# EAGLE design attiny44 (EAGLE 7.7.0)
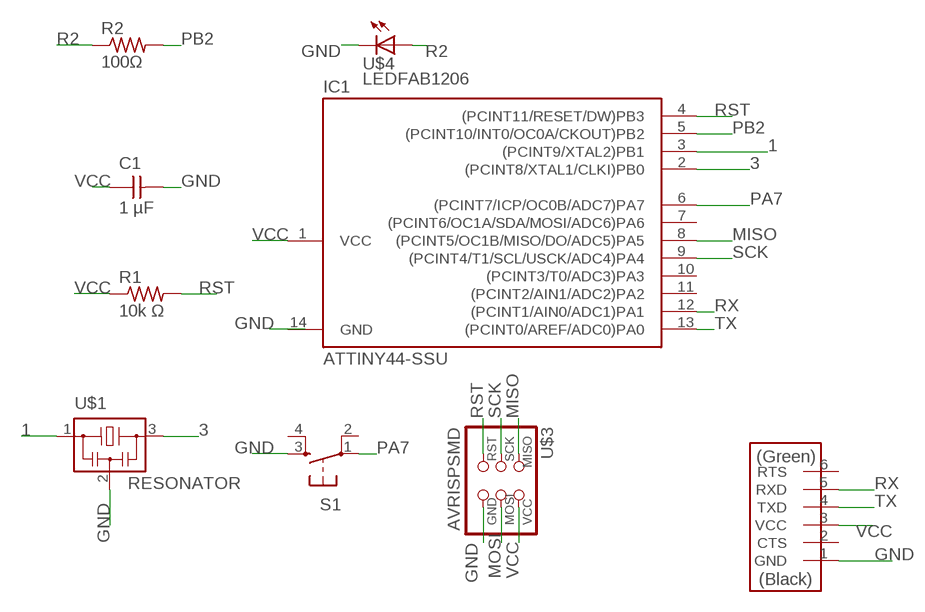
[diagram p0: schematic, sheet 1]

## Parts
C1  1 µF  CAP-UNPOLARIZEDFAB  [C1206FAB]
IC1  ATTINY44-SSU  [SOIC14]
R1  10k Ω  RES-US1206FAB  [R1206FAB]
R2  100Ω  RES-US1206FAB  [R1206FAB]
S1  6MM_SWITCH6MM_SWITCH  [6MM_SWITCH]
U$1  RESONATOR  [EFOBM]
U$2  FTDI-SMD-HEADER  [1X06SMD]
U$3  AVRISPSMD  [2X03SMD]
U$4  LEDFAB1206  [LED1206FAB]

## Nets
1: IC1.3((PCINT9/XTAL2)PB1) U$1.1
3: IC1.2((PCINT8/XTAL1/CLKI)PB0) U$1.3
GND: C1.2 S1.3(S) U$1.2 U$2.1(GND) U$3.6(GND) U$4.2(C)
MISO: IC1.8((PCINT5/OC1B/MISO/DO/ADC5)PA5) U$3.1(MISO)
MOSI: U$3.4(MOSI)
PA7: IC1.6((PCINT7/ICP/OC0B/ADC7)PA7) S1.1(P)
PB2: IC1.5((PCINT10/INT0/OC0A/CKOUT)PB2) R2.2
R2: R2.1 U$4.1(A)
RST: IC1.4((PCINT11/RESET/DW)PB3) R1.2 U$3.5(RST)
RX: IC1.12((PCINT1/AIN0/ADC1)PA1) U$2.5(RXD)
SCK: IC1.9((PCINT4/T1/SCL/USCK/ADC4)PA4) U$3.3(SCK)
TX: IC1.13((PCINT0/AREF/ADC0)PA0) U$2.4(TXD)
VCC: C1.1 IC1.1(VCC) R1.1 U$2.3(VCC) U$3.2(VCC)
Unconnected: IC1.7((PCINT6/OC1A/SDA/MOSI/ADC6)PA6) IC1.10((PCINT3/T0/ADC3)PA3) IC1.11((PCINT2/AIN1/ADC2)PA2) S1.2(P1) S1.4(S1) U$2.2(CTS) U$2.6(RTS)

## Power pins joined to a net without a drawn wire
GND: IC1.14(GND)

## Library data of the parts
C1 = 0_fab:CAP-UNPOLARIZED
IC1 = 0_fab:ATTINY44
R1 R2 = 0_fab:RES-US: Resistor (US Symbol) Variants with postfix FAB are widened to allow the routing of internal traces
S1 = 0_fab:6MM_SWITCH: OMRON SWITCH
U$1 = 0_fab:RESONATOR
U$2 = 0_fab:FTDI-SMD-HEADER
U$3 = 0_fab:AVRISP
U$4 = 0_fab:LED: LED

## Board
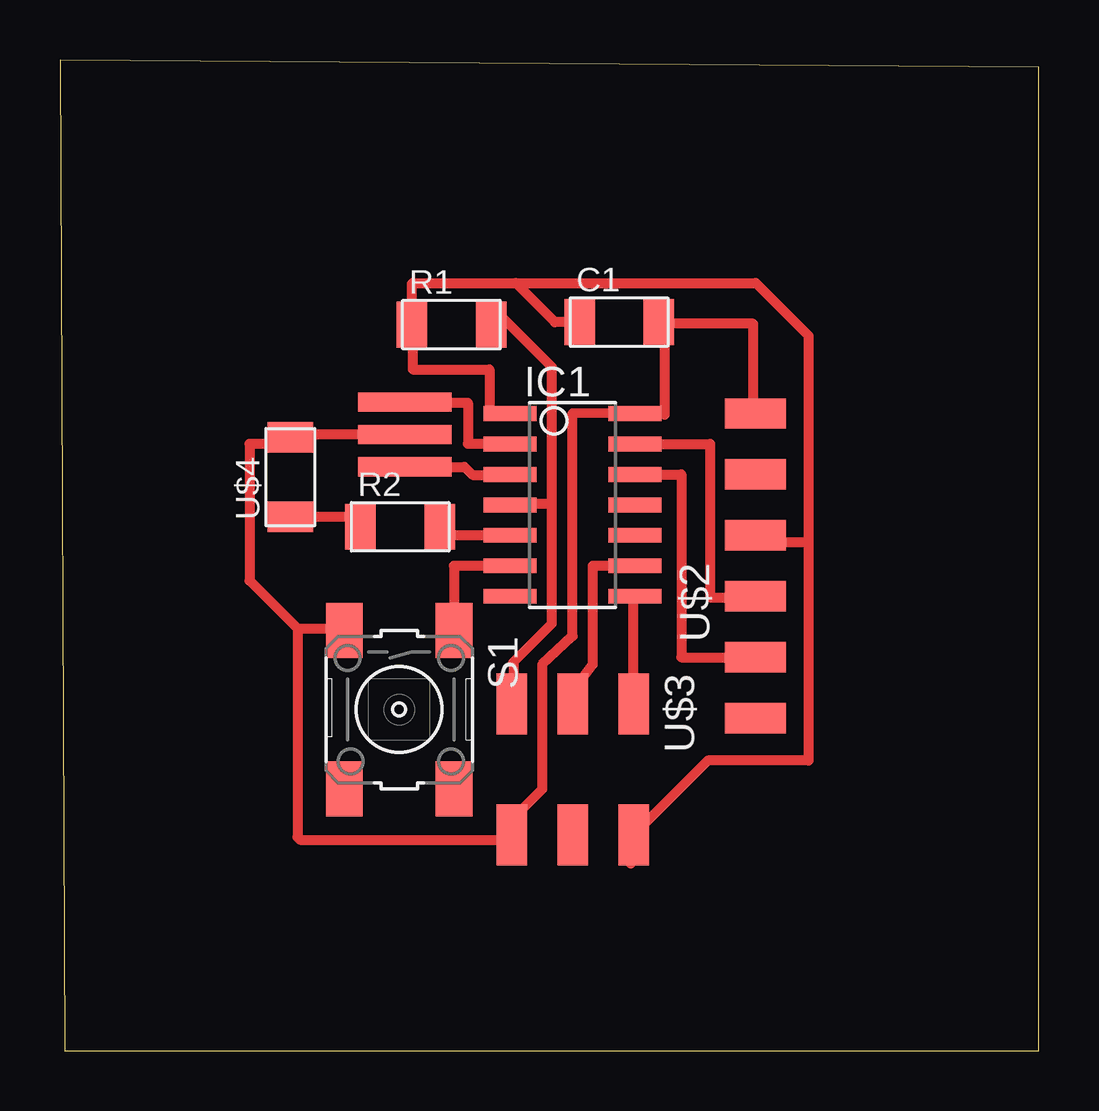
[diagram p1: board, top side]

Size 40.8 x 41.3 mm. Coordinates in mm from the lower left corner, seen from the top.
Outline: 0.2,0 40.8,0 40.8,41 0,41.3 0.2,0
Copper layers (1*16): Top 0.035mm / dielectric 1.5mm / Bottom 0.035mm
Design rules "default *": minimum track width 16mil, minimum drill 24mil, track to track 16mil, track to pad 16mil, pad to pad 16mil, via to via 16mil, smd to smd 16mil, copper to edge 40mil, drill to drill 8mil, minimum pad ring 10mil, minimum via ring 8mil, stop-mask expansion 4mil, vias tented up to drill 0mil, thermal gap 10mil

### Footprints (pad centres in the part's own frame; a part is rotated, then mirrored left to right if it is on the bottom)
C1206FAB = smd 1.27 x 1.905: 1 -1.651,0; 2 1.651,0
SOIC14 = smd 0.61 x 2.21: 1 -3.81,-2.603; 2 -2.54,-2.603; 3 -1.27,-2.603; 4 0,-2.603; 5 1.27,-2.603; 6 2.54,-2.603; 7 3.81,-2.603; 8 3.81,2.603; 9 2.54,2.603; 10 1.27,2.603; 11 0,2.603; 12 -1.27,2.603; 13 -2.54,2.603; 14 -3.81,2.603
R1206FAB = smd 1.27 x 1.905: 1 -1.651,0; 2 1.651,0
6MM_SWITCH = smd 2.286 x 1.524: 1 -3.302,2.286; 2 3.302,2.286; 3 -3.302,-2.286; 4 3.302,-2.286
EFOBM = smd 0.8 x 3.9: 1 -1.35,0; 2 0,0; 3 1.35,0
1X06SMD = smd 2.54 x 1.27: 1 0,6.35; 2 0,3.81; 3 0,1.27; 4 0,-1.27; 5 0,-3.81; 6 0,-6.35
2X03SMD = smd 2.54 x 1.27: 1 -2.54,2.54; 2 2.92,2.54; 3 -2.54,0; 4 2.92,0; 5 -2.54,-2.54; 6 2.92,-2.54
LED1206FAB = smd 1.27 x 1.905: 1 -1.651,0; 2 1.651,0

### Placement (x,y rotation side)
C1  23.31,30.37 0 top
IC1  21.37,22.75 270 top
R1  16.32,30.27 0 top
R2  14.18,21.84 0 top
S1  14.14,14.22 270 top
U$1  14.38,25.69 90 top
U$2  28.99,20.21 0 top
U$3  21.37,11.92 270 top
U$4  9.6,23.91 90 top

### Tracks (layer width: path | path; a pad name or v marks a point on that pad's centre or on a via)
1
  Top 0.406: 18.77,23.94 IC1.3 18.75,24 17.2,24 16.86,24.34 U$1.1
3
  Top 0.406: U$1.3 14.42,27 17,27 17,25.3 18.76,25.3 | 18.76,25.3 IC1.2 18.76,25.3
GND
  Top 0.406: 25.2,26.56 25.2,30.37 C1.2 24.96,30.3 28.9,30.3 28.9,26.56 U$2.1 | 9.9,17.6 7.9,19.6 7.9,25.29 9.83,25.29 U$4.2 9.6,25.69 U$1.2 | 9.9,17.6 11.78,17.6 S1.3 | 25.2,26.56 IC1.14 23.97,26.6 21.37,26.58 21.37,17.28 20.1,16.1 20.1,10.9 18.8,9.6 18.8,8.43 U$3.6 18.63,8.8 10,8.8 9.9,8.9 9.9,17.6 | 25.2,26.56 25.2,26.5
MISO
  Top 0.406: U$3.1 23.91,18.88 IC1.8
PA7
  Top 0.406: IC1.6 16.43,20.21 S1.1
PB2
  Top 0.406: IC1.5 15.43,21.48 R2.2
R2
  Top 0.406: 12.13,21.56 R2.1 12.11,22.26 U$4.1
RST
  Top 0.406: 20.49,22.8 20.49,28.51 18.4,30.6 18.3,30.6 R1.2 | 20.49,22.8 20.49,17.79 18.9,16.2 18.9,14.9 18.6,14.6 18.6,14.09 U$3.5 | IC1.4 18.45,22.75 18.4,22.8 | 18.4,22.8 18.3,22.8 | 18.4,22.8 20.49,22.8
RX
  Top 0.406: IC1.12 25.9,24.02 25.9,16.4 28.1,16.4 28.1,16.2 28.79,16.2 U$2.5
SCK
  Top 0.406: IC1.9 22.2,20.21 22.2,16.1 21.3,14.9 21.3,13.93 U$3.3
TX
  Top 0.406: IC1.13 27.1,25.29 27.1,18.9 28.95,18.9 U$2.4
VCC
  Top 0.406: 31.2,21.2 31.2,29.8 29,32 19,32 | 31.2,21.2 31.2,12.1 27.01,12.1 U$3.2 23.8,8.29 23.8,7.8 | C1.1 20.63,30.37 19,32 | 31.2,21.2 29.27,21.2 U$2.3 | IC1.1 18.77,26.6 17.9,26.6 17.9,28.4 14.7,28.4 14.7,30.27 R1.1 14.67,31.97 14.7,32 19,32